# EAGLE design attenuverting_mixer (EAGLE 8.3.2)
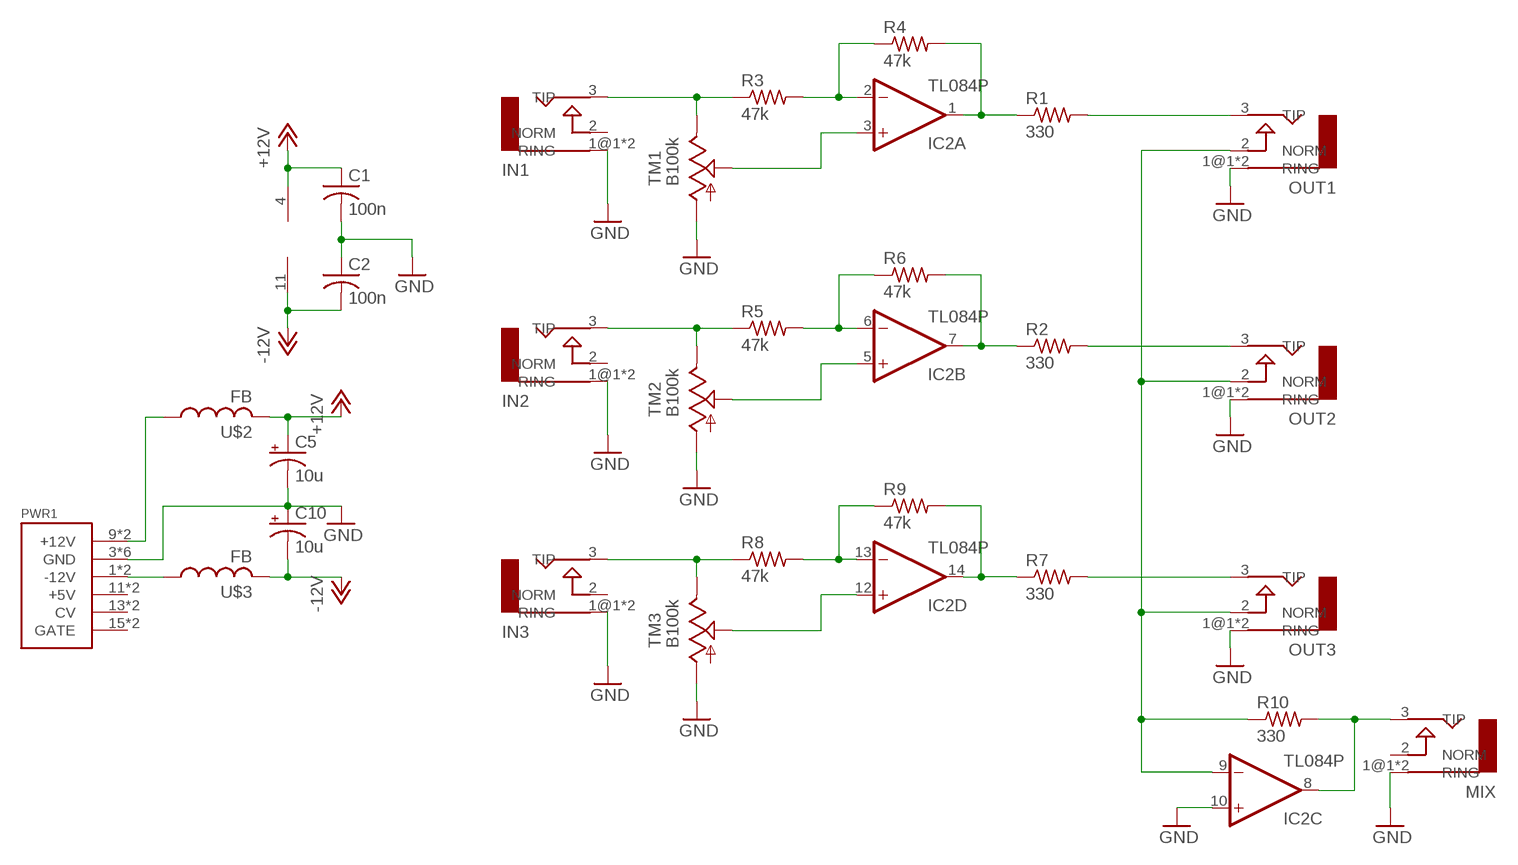
[diagram p0: schematic, sheet 1]

## Parts
C1  100n  C-USC1206  [C1206]
C2  100n  C-USC1206  [C1206]
C5  10u  CPOL-USB45181A  [B45181A]
C10  10u  CPOL-USB45181A  [B45181A]
IC2  TL084P  [DIL14]
IN1  AUDIO-JACKERTHENVAR  [ERTHENVAR-JACK]
IN2  AUDIO-JACKERTHENVAR  [ERTHENVAR-JACK]
IN3  AUDIO-JACKERTHENVAR  [ERTHENVAR-JACK]
MIX  AUDIO-JACKERTHENVAR  [ERTHENVAR-JACK]
OUT1  AUDIO-JACKERTHENVAR  [ERTHENVAR-JACK]
OUT2  AUDIO-JACKERTHENVAR  [ERTHENVAR-JACK]
OUT3  AUDIO-JACKERTHENVAR  [ERTHENVAR-JACK]
PWR1  POWER  [POWER_16]
R1  330  R-US_0207/7  [0207/7]
R2  330  R-US_0207/7  [0207/7]
R3  47k  R-US_0207/7  [0207/7]
R4  47k  R-US_0207/7  [0207/7]
R5  47k  R-US_0207/7  [0207/7]
R6  47k  R-US_0207/7  [0207/7]
R7  330  R-US_0207/7  [0207/7]
R8  47k  R-US_0207/7  [0207/7]
R9  47k  R-US_0207/7  [0207/7]
R10  330  R-US_0207/7  [0207/7]
TM1  B100k  TRIMSLIDE60  [SLIDEPOT-60]
TM2  B100k  TRIMSLIDE60  [SLIDEPOT-60]
TM3  B100k  TRIMSLIDE60  [SLIDEPOT-60]
U$2  FB  [FB]
U$3  FB  [FB]

## Nets
+12V: C1.1 C5.+ IC2.4(P:V+) U$2.P$2
-12V: C2.2 C10.- IC2.11(P:V-) U$3.P$2
GND: C1.2 C2.1 C5.- C10.+ IC2.10(C:+IN) IN1.1@1(RING) IN1.1@2(RING) IN2.1@1(RING) IN2.1@2(RING) IN3.1@1(RING) IN3.1@2(RING) MIX.1@1(RING) MIX.1@2(RING) OUT1.1@1(RING) OUT1.1@2(RING) OUT2.1@1(RING) OUT2.1@2(RING) OUT3.1@1(RING) OUT3.1@2(RING) PWR1.3(GND) PWR1.4(GND) PWR1.5(GND) PWR1.6(GND) PWR1.7(GND) PWR1.8(GND) TM1.A TM2.A TM3.A
N$1: IN2.3(TIP) R5.1 TM2.B
N$2: IN1.3(TIP) R3.1 TM1.B
N$3: IC2.2(A:-IN) R3.2 R4.1
N$4: IC2.1(A:OUT) R1.1 R4.2
N$5: OUT1.3(TIP) R1.2
N$6: IC2.3(A:+IN) TM1.WIPER
N$7: IC2.6(B:-IN) R5.2 R6.1
N$8: IC2.7(B:OUT) R2.1 R6.2
N$9: OUT2.3(TIP) R2.2
N$10: IC2.5(B:+IN) TM2.WIPER
N$11: PWR1.9(+12V) PWR1.10(+12V) U$2.P$1
N$12: IN3.3(TIP) R8.1 TM3.B
N$13: IC2.13(D:-IN) R8.2 R9.1
N$14: IC2.14(D:OUT) R7.1 R9.2
N$15: OUT3.3(TIP) R7.2
N$16: IC2.12(D:+IN) TM3.WIPER
N$17: PWR1.1(-12V) PWR1.2(-12V) U$3.P$1
N$18: IC2.9(C:-IN) OUT1.2(NORM) OUT2.2(NORM) OUT3.2(NORM) R10.1
N$19: IC2.8(C:OUT) MIX.3(TIP) R10.2
Unconnected: IN1.2(NORM) IN2.2(NORM) IN3.2(NORM) MIX.2(NORM) PWR1.11(+5V) PWR1.12(+5V) PWR1.13(CV) PWR1.14(CV) PWR1.15(GATE) PWR1.16(GATE)

## Library data of the parts
C1 C2 = rcl:C-US: CAPACITOR, American symbol
C5 C10 = rcl:CPOL-US: POLARIZED CAPACITOR, American symbol
IC2 = linear:TL084: OP AMP
IN1-IN3 MIX OUT1-OUT3 = erthenvar:AUDIO-JACK: Switching Mono 3.5mm Audio Jack from Erthenvar.
PWR1 = eurorack:POWER
R1-R10 = rcl:R-US_: RESISTOR, American symbol
TM1-TM3 = stefan-lochbrunner_EAGLE_master_custom libraries_potentiometers_Bourns PTA series_Bourns PTA series:TRIM: Sliding potentiometers Based on Adafruits (https://github.com/adafruit/Adafruit-Eagle-Library) 'TRIM' device. For Bourns PTA series and TT Electronics PSxx series potentiometers.
U$2 U$3 = adafruit:FB: Ferrite bead Digikey #P9821BK-ND

## Board
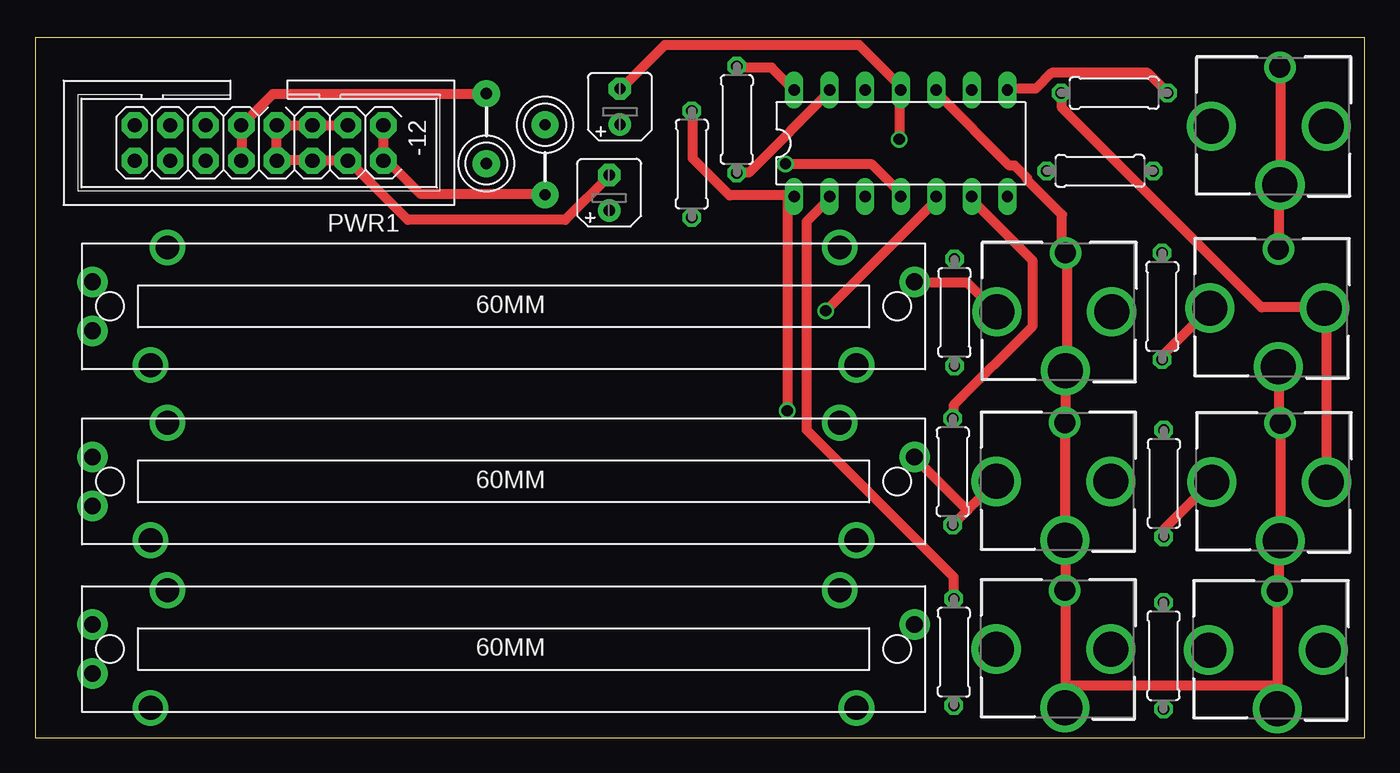
[diagram p1: board, top side]
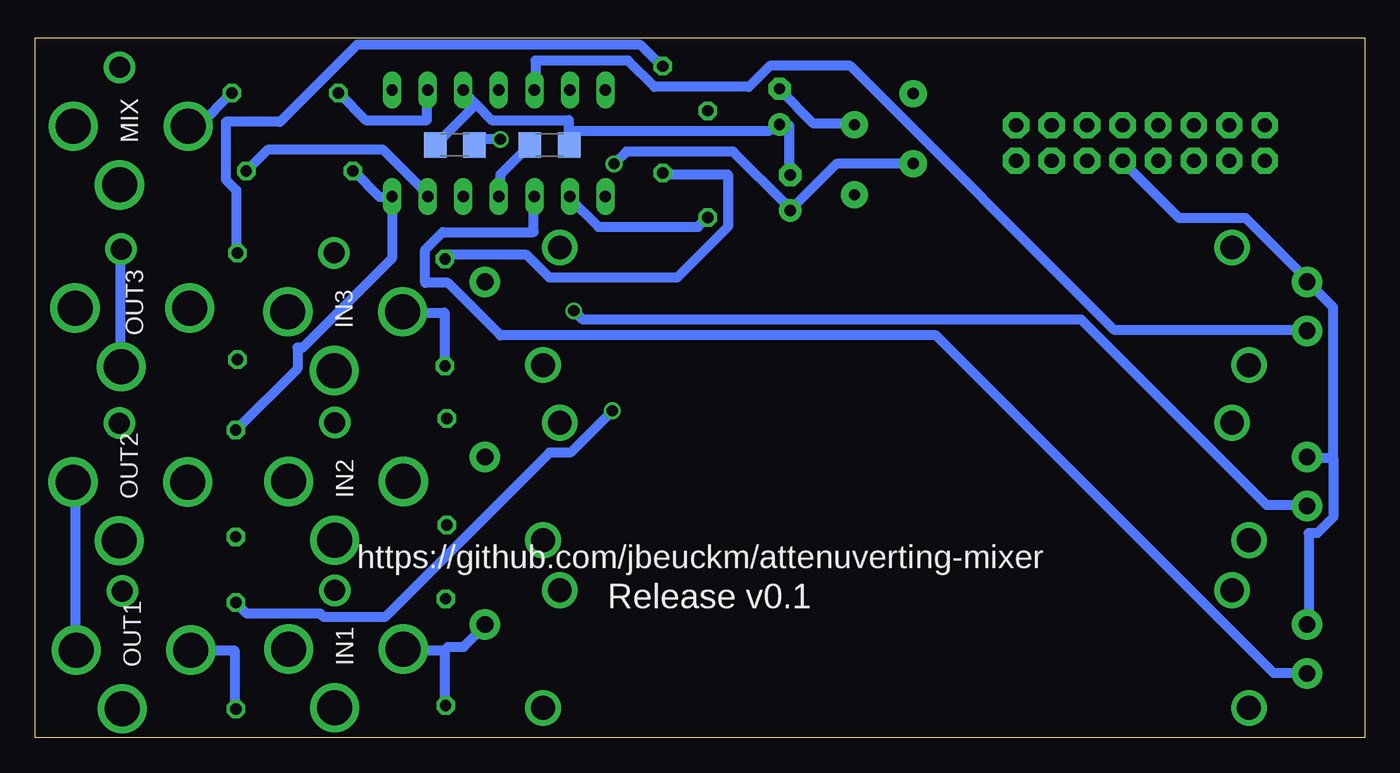
[diagram p2: board, bottom side, seen from below]

Size 95 x 50 mm. Coordinates in mm from the lower left corner, seen from the top.
Outline: 0,0 95,0 95,50 0,50 0,0
Copper layers (1*16): Top 0.035mm / dielectric 1.5mm / Bottom 0.035mm
Design rules "default *": minimum track width 28mil, minimum drill 31mil, track to track 16mil, track to pad 16mil, pad to pad 16mil, via to via 16mil, smd to smd 8mil, copper to edge 0mil, drill to drill 16mil, minimum pad ring 10mil, minimum via ring 8mil, stop-mask expansion 4mil, vias tented up to drill 0mil, thermal gap 10mil

### Footprints (pad centres in the part's own frame; a part is rotated, then mirrored left to right if it is on the bottom)
C1206 = smd 1.6 x 1.8: 1 -1.4,0; 2 1.4,0
B45181A = drill 0.813 pad 1.6: + -1.27,0 | drill 0.813 pad 1.6 octagon: - 1.27,0
DIL14 = drill 0.813 long: 1 -7.62,-3.81; 2 -5.08,-3.81; 3 -2.54,-3.81; 4 0,-3.81; 5 2.54,-3.81; 6 5.08,-3.81; 7 7.62,-3.81; 8 7.62,3.81; 9 5.08,3.81; 10 2.54,3.81; 11 0,3.81; 12 -2.54,3.81; 13 -5.08,3.81; 14 -7.62,3.81
ERTHENVAR-JACK = drill 2.5: 1@1 -4.2,0; 2 0,-3.3; 3 0,4.9 | drill 1.5: 1@2 4.2,0
POWER_16 = drill 1.016 pad 1.88 octagon: 1 -6.35,-1.27; 2 -6.35,1.27; 3 -3.81,-1.27; 4 -3.81,1.27; 5 -1.27,-1.27; 6 -1.27,1.27; 7 1.27,-1.27; 8 1.27,1.27; 9 3.81,-1.27; 10 3.81,1.27; 11 6.35,-1.27; 12 6.35,1.27; 13 8.89,-1.27; 14 8.89,1.27; 15 11.43,-1.27; 16 11.43,1.27
0207/7 = drill 0.813 octagon: 1 -3.81,0; 2 3.81,0
SLIDEPOT-60 = drill 1.2 pad 2.184: A -29.37,1.75; B 29.37,1.75; WIPER -29.37,-1.75 | drill 1.7 pad 2.54: P$1 -24.02,4.2; P$2 24.02,4.2; P$3 -25.22,-4.2; P$4 25.22,-4.2
FB = drill 0.8 pad 1.93: P$1 -2.5,0; P$2 2.5,0

### Placement (x,y rotation side)
C1  58.23,42.35 0 bottom
C2  65,42.36 0 bottom
C5  41.03,38.95 90 top
C10  41.8,45.1 90 top
IC2  61.86,42.48 0 top
IN1  73.58,6.35 90 top
IN2  73.58,18.32 90 top
IN3  73.63,30.44 90 top
MIX  88.96,43.7 90 top
OUT1  88.76,6.28 90 top
OUT2  88.98,18.28 90 top
OUT3  88.84,30.71 90 top
PWR1  18.55,42.5 180 top
R1  80.64,5.88 270 top
R2  80.66,18.18 270 top
R3  65.66,6.13 90 top
R4  46.93,40.99 90 top
R5  65.58,19.01 90 top
R6  76.1,40.5 180 top
R7  80.54,30.83 270 top
R8  65.7,30.39 90 top
R9  50.15,44.17 90 top
R10  77.12,46.07 0 top
TM1  33.48,6.35 0 top
TM2  33.48,18.32 0 top
TM3  33.48,30.83 0 top
U$2  32.25,43.53 270 top
U$3  36.45,41.3 90 top

### Tracks (layer width: path | path; a pad name or v marks a point on that pad's centre or on a via)
+12V  (via drill 0.79)
  Top 0.711: v53.62,41 59.75,41 61.75,39 61.75,38.75 IC2.4
  Bottom 0.711: C1.1 59.75,42.25 61.75,40.25 61.75,38.75 IC2.4 | U$2.P$2 32.25,41 37.75,41 41,37.75 C5.+ 41.25,38 45.12,41.88 52.75,41.88 v53.62,41
-12V  (via drill 0.79)
  Top 0.711: v61.75,42.75 61.75,46.25 IC2.11 61.75,46.62 58.88,49.5 45,49.5 41.88,46.38 C10.-
  Bottom 0.711: v61.75,42.75 63.12,42.75 63.5,42.38 C2.2 | C10.- 41.75,46.25 39.38,43.88 36.5,43.88 U$3.P$2
GND
  Top 0.711: PWR1.3 22.25,43.75 20.12,43.75 PWR1.5 19.75,43.75 17.62,43.75 PWR1.7 17.25,43.75 17.25,41.5 PWR1.8 17.38,41.25 19.75,41.25 PWR1.6 20.12,41.25 22.25,41.25 PWR1.4 22.62,41 26.62,37 37.88,37 41,40.12 C5.- | OUT3.1@2 88.88,35 88.88,39.5 MIX.1@1 89,39.75 89,47.88 MIX.1@2 | OUT3.1@1 88.88,26.5 88.88,22.5 OUT2.1@2 89,22.12 89,14.38 OUT2.1@1 88.88,14 88.88,10.5 OUT1.1@2 88.75,10.12 88.75,2.12 OUT1.1@1 88.5,3.75 73.88,3.75 IN1.1@1 73.62,2.25 73.62,10.25 IN1.1@2 73.62,10.62 73.62,14 IN2.1@1 73.62,14.38 73.62,22.25 IN2.1@2 73.62,22.62 73.62,26.12 IN3.1@1 73.75,26.5 73.75,34.62 IN3.1@2 73.38,34.88 73.38,37.38 70.88,39.88 70.88,40 70,40.88 69.62,40.88 64.5,46 64.5,46.25 IC2.10
  Bottom 0.711: 2.25,20 2.25,15.75 3.38,14.62 4,14.62 4,8.12 TM1.A | 2.25,20 4,20 TM2.A | 2.25,20 2.25,30.75 4,32.5 TM3.A 4.25,32.88 8.5,37.12 13.25,37.12 17.25,41.12 PWR1.8 | OUT3.1@2 88.88,34.88 88.88,26.62 OUT3.1@1 | C5.- 41.12,40.25 41.12,43.75 41.75,43.75 C10.+ 42.12,43.75 42.5,43.38 56.88,43.38 | 56.88,43.38 56.88,44.12 62.38,44.12 63.5,45.25 | 56.88,43.38 56.88,42.38 C1.2 | 63.5,45.25 64.5,46.25 IC2.10 | 63.5,45.25 66.38,42.38 C2.1
N$1
  Top 0.711: 66.62,16.25 68.62,18.25 IN2.3 | 66.62,16.25 65.62,15.25 R5.1 | 66.62,16.25 62.88,20 TM2.B
N$2
  Bottom 0.711: 65.75,6.25 65.75,2.38 R3.1 | 65.75,6.25 68.62,6.25 IN1.3 | TM1.B 62.88,8 64.38,6.5 65.5,6.5 65.75,6.25
N$3
  Top 0.711: R3.2 65.62,10 65.62,11.5 55.12,22 55.12,36.88 56.88,38.62 IC2.2
  Bottom 0.711: R4.1 47,37.12 47.62,36.5 54.75,36.5 56.88,38.62 IC2.2
N$4  (via drill 0.79)
  Top 0.711: R4.2 47,44.75 47,41.38 49.62,38.75 54.12,38.75 IC2.1 53.75,38.5 v53.75,23.38
  Bottom 0.711: v53.75,23.38 56.75,20.38 58.25,20.38 70,8.62 74.38,8.62 74.62,8.88 79.88,8.88 80.62,9.62 R1.1
N$5
  Bottom 0.711: R1.2 80.75,2.12 80.75,6.25 83.75,6.25 OUT1.3
N$6
  Bottom 0.711: IC2.3 59.38,38.62 59.38,36.12 65.88,36.12 67.12,34.88 67.12,32.5 65.5,32.5 61.75,28.75 30.62,28.75 6.5,4.62 4.12,4.62 TM1.WIPER
N$7
  Top 0.711: R5.2 65.62,22.88 65.62,23.75 71.25,29.38 71.25,34.12 67,38.38 67,38.62 IC2.6
  Bottom 0.711: R6.1 79.88,40.5 78.38,42 70.12,42 66.88,38.75 IC2.6
N$8
  Bottom 0.711: R2.1 80.62,22 76.25,26.38 76.25,27.88 75.88,27.88 69.5,34.25 69.5,38.62 IC2.7 69.88,38.62 70.38,38.62 72.25,40.5 R6.2
N$9
  Top 0.711: R2.2 80.75,14.38 80.75,15 84,18.25 OUT2.3
N$10  (via drill 0.79)
  Top 0.711: v56.5,30.5 64.38,38.38 64.38,38.62 IC2.5
  Bottom 0.711: v56.5,30.5 55.88,29.88 20.25,29.88 7,16.62 4.12,16.62 TM2.WIPER
N$11
  Top 0.711: PWR1.10 14.75,41.25 14.75,43.75 PWR1.9 15,44 17,46 32.25,46 U$2.P$1
N$12
  Top 0.711: TM3.B 62.88,32.5 66.62,32.5 68.62,30.5 IN3.3
  Bottom 0.711: R8.1 65.75,26.62 65.75,30.38 68.62,30.38 IN3.3
N$13
  Top 0.711: R9.1 50.25,40.38 51,40.38 56.88,46.25 IC2.13
  Bottom 0.711: R8.2 65.62,34.25 65.38,34.5 59.88,34.5 58.25,32.88 49.12,32.88 45.5,36.5 45.5,40.25 50.12,40.25 R9.1
N$14
  Top 0.711: R9.2 50.25,47.88 52.62,47.88 54.12,46.38 IC2.14
  Bottom 0.711: R7.1 80.62,34.75 80.62,39.12 81.38,39.88 81.38,44 77.5,44 72,49.5 51.75,49.5 50.25,48 R9.2
N$15
  Top 0.711: R7.2 80.62,27.12 80.62,27.38 83.88,30.62 OUT3.3
N$16
  Bottom 0.711: IC2.12 59.25,46.38 59.25,48.38 52.62,48.38 50.75,46.5 44,46.5 42.5,48 36.75,48 17.88,29.12 4.12,29.12 TM3.WIPER
N$17
  Top 0.711: PWR1.1 24.88,43.75 24.88,41.25 PWR1.2 25.25,41.12 27.5,38.88 36.38,38.88 U$3.P$1
N$18
  Top 0.711: R10.1 73.38,46 73.38,45 87.62,30.75 92.12,30.75 OUT3.2 92.25,30.38 92.25,18.38 OUT2.2
  Bottom 0.711: OUT1.2 92.12,6.38 92.12,18.25 92.25,18.25 OUT2.2 | IC2.9 67,46.25 67,44.12 71.38,44.12 73.25,46 R10.1
N$19
  Top 0.711: R10.2 79.5,47.5 72.62,47.5 71.5,46.38 69.5,46.38 IC2.8
  Bottom 0.711: R10.2 83.25,43.75 84,43.75 MIX.3

### Text on the board
bNames: https://github.com/jbeuckm/attenuverting-mixer | Release v0.1